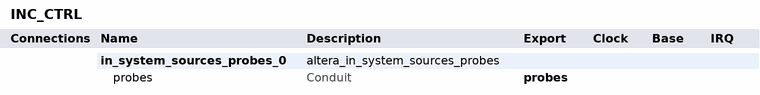
[diagram p0: system contents]
# Platform Designer (Qsys) system INC_CTRL, MAX 10 10M25DAF484C8G
# Parameters at their usual value, and those the tool derives, are not listed.
package require -exact qsys 22.1
create_system INC_CTRL
set_project_property DEVICE_FAMILY {MAX 10}
set_project_property DEVICE 10M25DAF484C8G

add_instance in_system_sources_probes_0 altera_in_system_sources_probes 22.1
set_instance_property in_system_sources_probes_0 AUTO_EXPORT true
set_instance_parameter_value in_system_sources_probes_0 create_source_clock false
set_instance_parameter_value in_system_sources_probes_0 instance_id NONE
set_instance_parameter_value in_system_sources_probes_0 probe_width 32
set_instance_parameter_value in_system_sources_probes_0 source_width 0

# exported interfaces
add_interface probes conduit end
set_interface_property probes EXPORT_OF in_system_sources_probes_0.probes

set_interconnect_requirement {$system} qsys_mm.clockCrossingAdapter HANDSHAKE
set_interconnect_requirement {$system} qsys_mm.enableEccProtection FALSE
set_interconnect_requirement {$system} qsys_mm.insertDefaultSlave FALSE
set_interconnect_requirement {$system} qsys_mm.maxAdditionalLatency 1

save_system INC_CTRL.qsys
